# EAGLE design PCB_Sensor_Board_2.x_BME280_680_ATH10_HDC1080 (EAGLE 9.6.2)
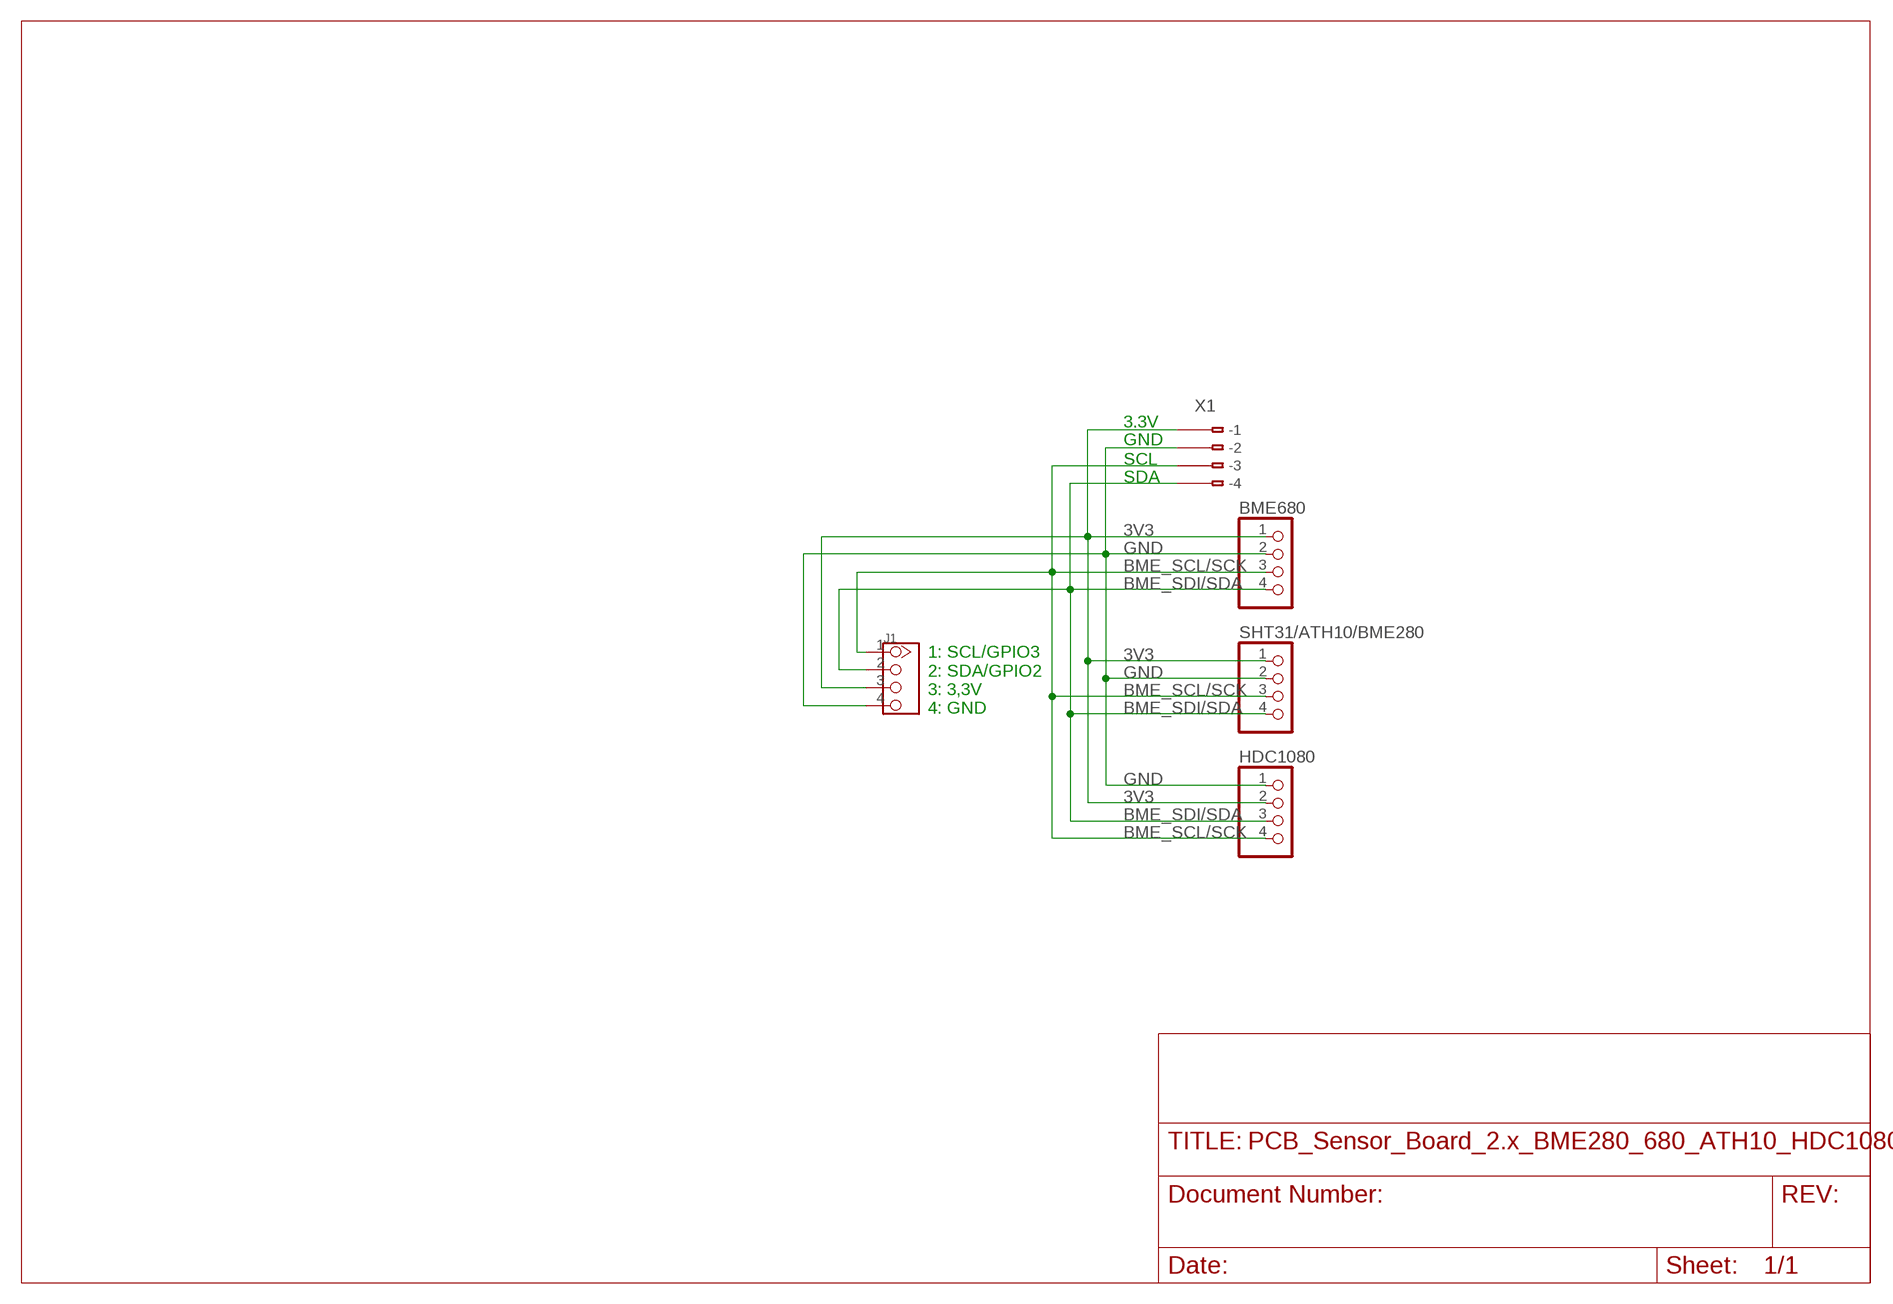
[diagram p0: schematic, sheet 1]

## Parts
BME680  PINHD-1X4  [1X04]
HDC1080  PINHD-1X4  [1X04]
J1  TWIG-4P-2.0-2.0  [4P-2.0]
SHT31/ATH10/BME280  PINHD-1X4  [1X04]
X1  233-504  [233-504]

## Nets
3V3 [Supply3v3]: BME680.1 HDC1080.2 J1.3 SHT31/ATH10/BME280.1 X1.B1(B-1)
BME_SCL/SCK: BME680.3 HDC1080.4 J1.1 SHT31/ATH10/BME280.3 X1.B3(B-3)
BME_SDI/SDA: BME680.4 HDC1080.3 J1.2 SHT31/ATH10/BME280.4 X1.B4(B-4)
GND [Supply5v]: BME680.2 HDC1080.1 J1.4 SHT31/ATH10/BME280.2 X1.B2(B-2)
Unconnected: X1.A1(-1) X1.A2(-2) X1.A3(-3) X1.A4(-4)

## Notes on the sheet
- 3.3V
- GND
- SCL
- SDA
- 1: SCL/GPIO3
  2: SDA/GPIO2
  3: 3,3V
  4: GND

## Library data of the parts
BME680 HDC1080 SHT31/ATH10/BME280 = pinhead:PINHD-1X4: PIN HEADER
J1 = Connector:TWIG-4P-2.0: Grove Stecker RM 2mm 4Pol
X1 = con-wago:233-504: WAGO Cage Clamp; MF: Wago Corporation; MPN: 0233-0504; OC_FARNELL: 1777098; OC_NEWARK: 79K2050

## Net classes
0 Signal: width 0.127 mm, clearance 0.381 mm
1 Supply3v3: width 0.254 mm, clearance 0.381 mm
2 Supply5v: width 0.381 mm, clearance 0.381 mm

## Board
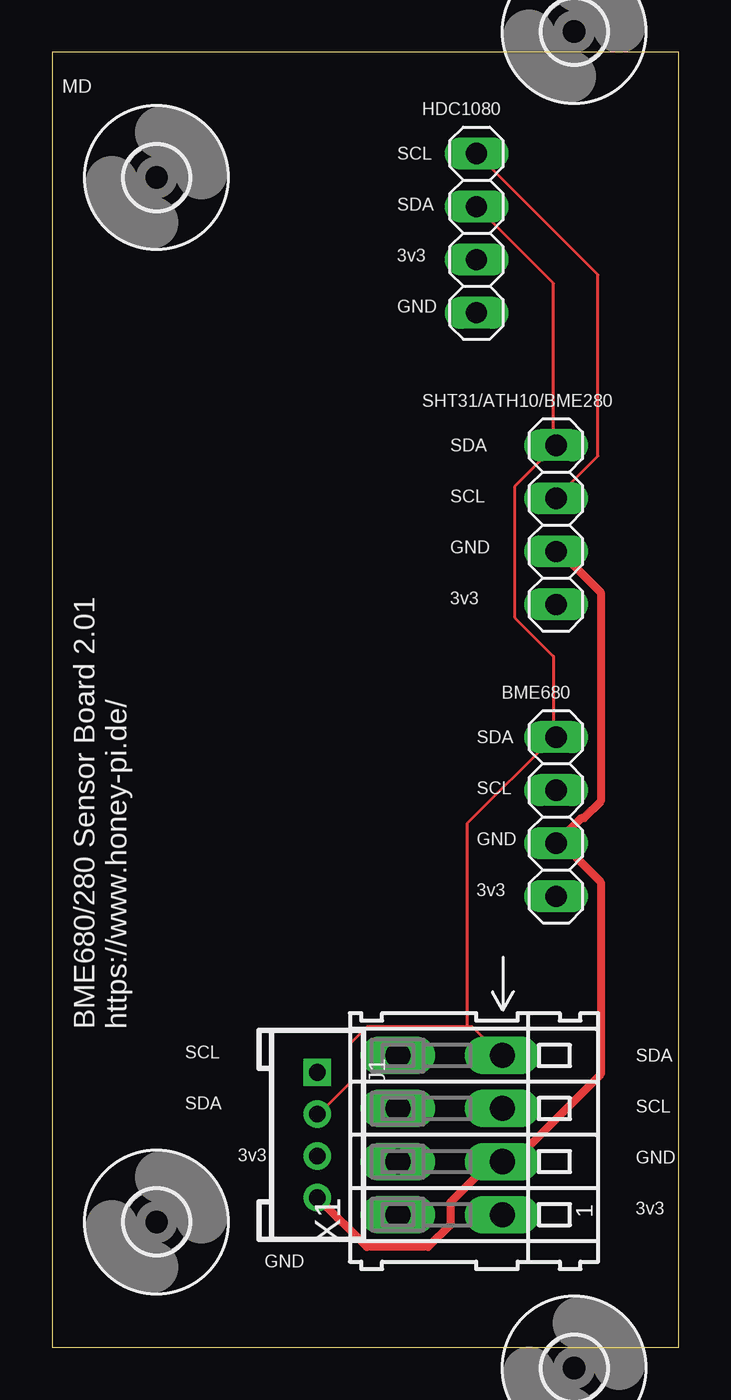
[diagram p1: board, top side]
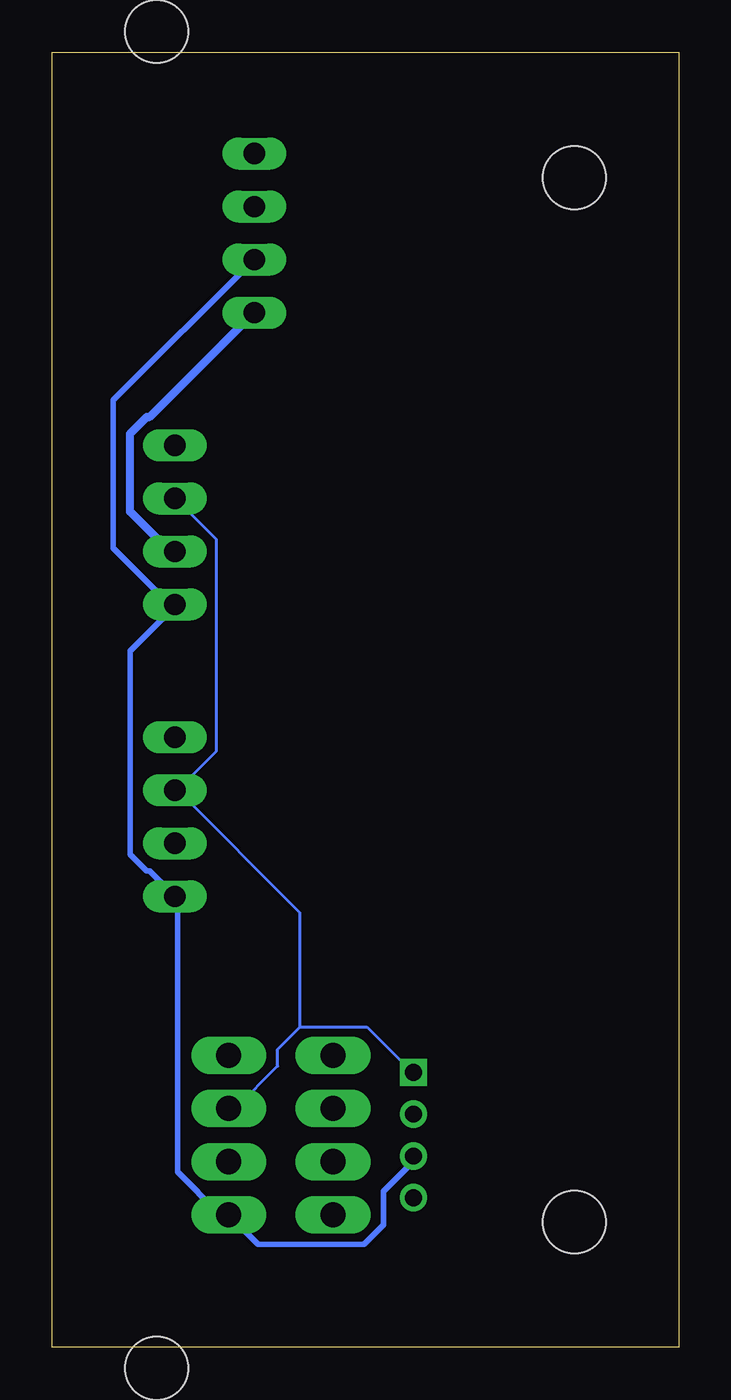
[diagram p2: board, bottom side, seen from below]

Size 30 x 62 mm. Coordinates in mm from the lower left corner, seen from the top.
Outline: 0,0 30,0 30,62 0,62 0,0
Copper layers (1*16): Top 0.035mm / dielectric 1.5mm / Bottom 0.035mm
Design rules "default *": minimum track width 6mil, minimum drill 0.35mm, track to track 6mil, track to pad 6mil, pad to pad 6mil, via to via 6mil, smd to smd 6mil, copper to edge 40mil, drill to drill 1mm, minimum pad ring 10mil, minimum via ring 8mil, stop-mask expansion 4mil, vias tented up to drill 0mil, thermal gap 10mil

### Footprints (pad centres in the part's own frame; a part is rotated, then mirrored left to right if it is on the bottom)
1X04 = drill 1.016 long: 1 -3.81,0; 2 -1.27,0; 3 1.27,0; 4 3.81,0
4P-2.0 = drill 0.8 pad 1.27 square: 1 -3,0 | drill 0.8 pad 1.27: 2 -1,0; 3 1,0; 4 3,0
3,0 = hole 3: 0,0
233-504 = drill 1.2 long: A1 -3.81,2.5; A2 -1.27,2.5; A3 1.27,2.5; A4 3.81,2.5; B1 -3.81,-2.5; B2 -1.27,-2.5; B3 1.27,-2.5; B4 3.81,-2.5

### Placement (x,y rotation side)
BME680  24.13,25.4 90 top
HDC1080  20.32,53.34 90 top
J1  12.7,10.16 270 top
SHT31/ATH10/BME280  24.13,39.37 90 top
U$1  [3,0]  25,63 0 top
U$2  [3,0]  5,56 0 top
U$3  [3,0]  25,-1 0 top
U$4  [3,0]  5,6 0 top
X1  19.05,10.16 90 top

### Tracks (layer width: path | path; a pad name or v marks a point on that pad's centre or on a via)
3V3
  Bottom 0.254: J1.3 12.8,9.07 12.8,8.8 14.13,7.47 14.13,5.87 15.07,4.93 20.14,4.93 21.47,6.27 X1.B1 21.6,6.4 22,6.4 24,8.4 24,21.47 BME680.1 24.14,21.6 25.34,22.8 25.47,22.8 26.27,23.6 26.27,33.34 24.14,35.47 SHT31/ATH10/BME280.1 24.27,35.47 27.07,38.27 27.07,45.34 20.4,52.01 HDC1080.2
BME_SCL/SCK
  Top 0.152: HDC1080.4 20.4,57.07 26.14,51.34 26.14,42.67 24.14,40.67 SHT31/ATH10/BME280.3
  Bottom 0.152: 18.14,15.34 14.94,15.34 12.8,13.2 J1.1 | 18.14,15.34 19.2,14.27 19.2,13.47 21.2,11.47 21.47,11.47 X1.B3 | 24,26.67 18.14,20.8 18.14,15.34 | 24,26.67 22.14,28.54 22.14,38.67 24,40.54 SHT31/ATH10/BME280.3 | 24,26.67 BME680.3
BME_SDI/SDA
  Top 0.152: 19.87,15.34 20.14,15.34 21.47,14 X1.B4 | 19.87,15.34 15.07,15.34 14.27,14.54 14.27,12.67 12.8,11.2 J1.2 | HDC1080.3 20.4,54.54 24,50.94 24,43.2 SHT31/ATH10/BME280.4 24,43.07 22.14,41.2 22.14,34.94 24,33.07 24,29.34 BME680.4 24,29.2 19.87,25.07 19.87,15.34
GND
  Top 0.381: J1.4 12.8,7.07 15.07,4.8 18,4.8 19.07,5.87 19.07,6.93 20.94,8.8 21.47,8.8 X1.B2 21.74,8.93 22.14,8.93 26.27,13.07 26.27,22.27 24.4,24.14 BME680.2 25.34,25.34 25.47,25.34 26.27,26.14 26.27,36.14 24.4,38.01 24.14,38.01 SHT31/ATH10/BME280.2
  Bottom 0.381: HDC1080.1 20.4,49.47 25.34,44.54 25.47,44.54 26.27,43.74 26.27,40.01 24.4,38.14 24.14,38.14 SHT31/ATH10/BME280.2

### Text on the board
tNames: MD | SCL / / SDA / / 3v3 / / GND | SDA / / SCL / / GND / / 3v3 | SDA / / SCL / / GND / / 3v3 | BME680/280 Sensor Board 2.01 / https://www.honey-pi.de/ | SCL / / SDA | 3v3 | SDA / / SCL / / GND / / 3v3 | GND